# Altium schematic sheet UC3843_SWITCHING_POWER_SUPPLY_V1.SchDoc
size A4; SheetNumber: 1; SheetTotal: 1
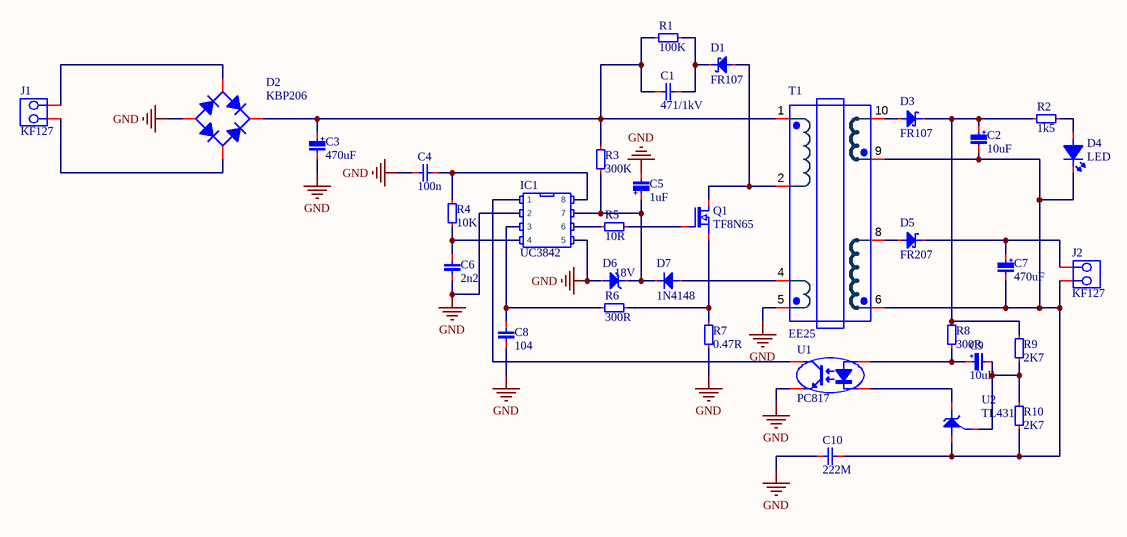
[diagram p0: UC3843_SWITCHING_POWER_SUPPLY_V1.SchDoc]

## Parts
C1  471/1kV  [CAP_Ceramic_5MM]
C2  10uF  [CAP_RAD_D05x11]
C3  470uF  [CAP_RAD_D10x12.5]
C4  100n  [CAP_Ceramic_2.5MM]
C5  1uF  [CAP_RAD_D05x11]
C6  2n2  [CAP_Ceramic_2.5MM]
C7  470uF  [CAP_RAD_D10x12.5]
C8  104  [CAP_Ceramic_2.5MM]
C9  10uF  [CAP_RAD_D05x11]
C10  222M  [CAP_Ceramic_473M_9.65mm]
D1  FR107  [DO-204AL-BK]
D2  KBP206  [DIODE-KBP206]
D3  FR107  [DO-204AL-BK]
D4  LED  [LED_5MM]
D5  FR207  [DO-204AC-BK]
D6  18V  [DO-204AL-RD]
D7  1N4148  [DO-204AH-RD]
IC1  UC3842  [DIP-8]
J1  KF127  [DG127-5.0-02P-14-00AH]
J2  KF127  [DG127-5.0-02P-14-00AH]
Q1  TF8N65  [TO-220F-HEAT-SINK]
R1  100K  [RES-0.5W-H]
R2  1k5  [RES-0.25W-H]
R3  300K  [RES-1W-V]
R4  10K  [RES-0.25W-H]
R5  10R  [RES-0.25W-H]
R6  300R  [RES-0.25W-H]
R7  0.47R  [RES-1W-V]
R8  300R  [RES-0.25W-H]
R9  2K7  [RES-0.25W-H]
R10  2K7  [RES-0.25W-H]
T1  EE25  [TRANSFORMER-EE25-10-6-VERTICAL(5+5)]
U1  PC817  [PC817-DIP]
U2  TL431  [TO-92]

## Nets
GND: C3.2 C4.2 C5.2 C6.1 C8.1 C10.1 D2.4(-) D6.1 IC1.2 IC1.5 R7.1 T1.5 U1.3(E)
NetC1_1: C1.1 D1.2 R1.1
NetC1_2: C1.2 C3.1 D2.1(+) R1.2 R3.2 T1.1
NetC2_1: C2.1 D3.2 R2.2 R8.2 R9.2
NetC2_2: C2.2 C7.2 C10.2 D4.2(K) J2.2 R10.1 T1.6 T1.9 U2.2
NetC4_1: C4.1 IC1.8 R4.2
NetC5_1: C5.1 D6.2 D7.2 IC1.7 R3.1
NetC6_2: C6.2 IC1.4 R4.1
NetC7_1: C7.1 D5.2 J2.1
NetC8_2: C8.2 IC1.3 R6.1
NetC9_1: C9.1 R8.1 U1.1(A)
NetC9_2: C9.2 R9.1 R10.2 U2.1
NetD1_1: D1.1 Q1.2(D) T1.2
NetD2_2: D2.2(AC) J1.2
NetD2_3: D2.3(AC) J1.1
NetD3_1: D3.1 T1.10
NetD4_1: D4.1(A) R2.1
NetD5_1: D5.1 T1.8
NetD7_1: D7.1 T1.4
NetIC1_1: IC1.1 U1.4(C)
NetIC1_6: IC1.6 R5.1
NetQ1_1: Q1.1(G) R5.2
NetQ1_3: Q1.3(S) R6.2 R7.2
NetU1_2: U1.2(K) U2.3

## Notes on the sheet
- (in symbol Capacitor(Radian)) +

## Library data of the parts
C1 C4 C6 C8 C10 = Capacitors(Disc)
C2 C3 C5 C7 C9 = Capacitor(Radian)
D1 D3 = Diode-FR107: 1A 1000V
D2 = Diode-KBP206
D4 = LED 5MM
D5 = Diode-FR207
D6 = Diode-Zener
D7 = Diode-1N4148: The fast switching diode
IC1 = SMPS-UC3842: Operating Frequency up to 500KHz
J1 J2 = DG127-5.0-02P-14-00AH
Q1 = Mostfet-TF8N65: VDS = 650V / ID (at VGS=10V) 8A / RDS(ON) (at VGS=10V) < 1.15Ω
R1-R10 = Resistors THD
T1 = TRANS-EE25-10-6-VERTICAL(5+5)
U1 = Opto-PC817
U2 = Ic-TL431